# Altium schematic sheet RED LED SCH.schdoc
size 44 x 31 mm
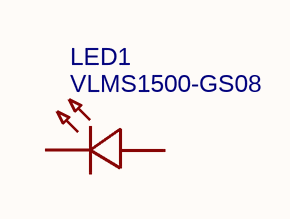
[diagram p0: RED LED SCH.schdoc]

## Parts
LED1  VLMS1500-GS08  [LED0402-RD_RED]

## Nets

Not connected (* = marked no-connect by the designer): LED1 1(-) 2(+)

## Library data of the parts
LED1 = VLMS1500-GS08: Manufacturer: VISHAY(威世); Contributor: LCSC; Supplier: LCSC; Supplier Part: C511370; Manufacturer Part: VLMS1500-GS08; JLCPCB Part Class: Extended Part; spicePre: L; spiceSymbolName: VLMS1500-GS08